# EAGLE design T1Triak+Diak (EAGLE 8.4.0)
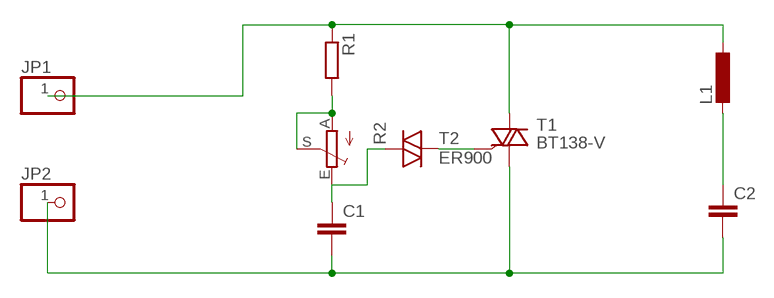
[diagram p0: schematic, sheet 1]

## Parts
C1  C-EU225-062X268  [C225-062X268]
C2  C-EU050-030X075  [C050-030X075]
JP1  PINHD-1X1  [1X01]
JP2  PINHD-1X1  [1X01]
L1  L-EU0204/5  [0204/5]
R1  R-EU_0207/10  [0207/10]
R2  TRIM_EU-B64Y  [B64Y]
T1  BT138-V  [TO220BV]
T2  ER900  [ER900]

## Nets
N$1: JP1.1 L1.1 R1.1 T1.T2(A2)
N$2: T1.G T2.2
N$3: C2.1 L1.2
N$4: C1.2 C2.2 JP2.1 T1.T1(A1)
N$5: R1.2 R2.A R2.S
N$6: C1.1 R2.E T2.1

## Library data of the parts
C1 C2 = resistor:C-EU: CAPACITOR, European symbol
JP1 JP2 = pinhead:PINHD-1X1: PIN HEADER
L1 = resistor:L-EU: INDUCTOR, European symbol
R1 = resistor:R-EU_: RESISTOR, European symbol
R2 = pot:TRIM_EU-: POTENTIOMETER
T1 = triac:BT138: TRIAC Source: http://www.semiconductors.philips.com BT138_SERIES_2.pdf
T2 = triac:ER900: TRIGGER DIODE

## Board
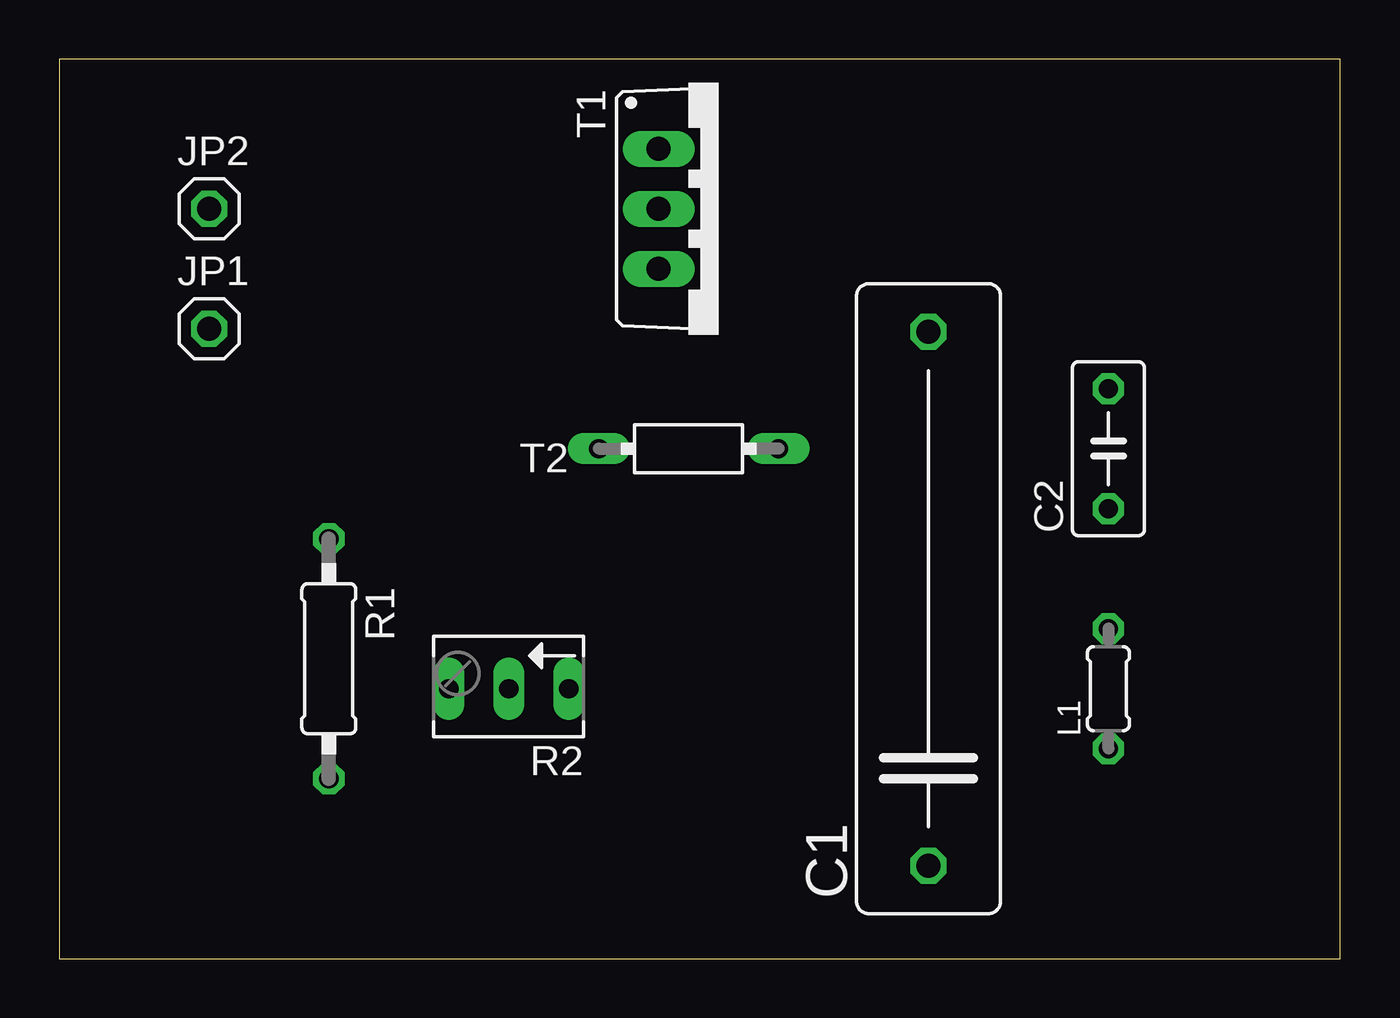
[diagram p1: board, top side]
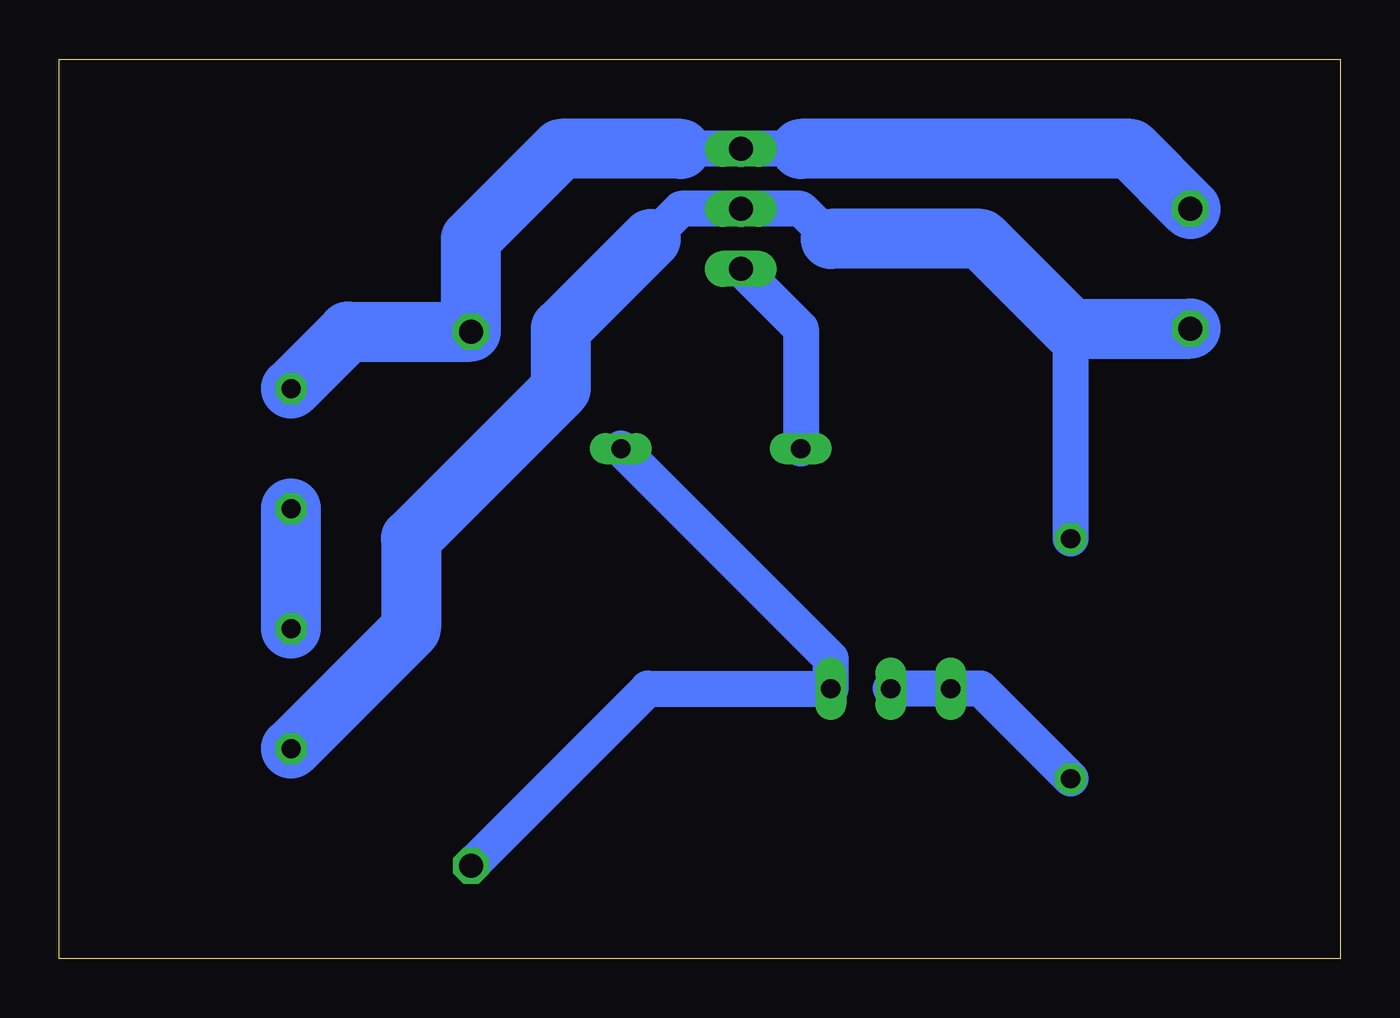
[diagram p2: board, bottom side, seen from below]

Size 54.28 x 38.09 mm. Coordinates in mm from the lower left corner, seen from the top.
Outline: 0,0 54.28,0 54.28,38.09 0,38.09 0,0
Copper layers (1*16): Top 0.035mm / dielectric 1.5mm / Bottom 0.035mm
Design rules "default": minimum track width 6mil, minimum drill 0.35mm, track to track 6mil, track to pad 6mil, pad to pad 6mil, via to via 6mil, smd to smd 6mil, copper to edge 40mil, drill to drill 6mil, minimum pad ring 10mil, minimum via ring 8mil, stop-mask expansion 4mil, vias tented up to drill 0mil, thermal gap 10mil

### Footprints (pad centres in the part's own frame; a part is rotated, then mirrored left to right if it is on the bottom)
C225-062X268 = drill 1.016 octagon: 1 -11.303,0; 2 11.303,0
C050-030X075 = drill 0.813 octagon: 1 -2.54,0; 2 2.54,0
1X01 = drill 1.016 octagon: 1 0,0
0204/5 = drill 0.813 octagon: 1 -2.54,0; 2 2.54,0
0207/10 = drill 0.813 octagon: 1 -5.08,0; 2 5.08,0
B64Y = drill 0.813 long: A 2.54,0; E -2.54,0; S 0,0
TO220BV = drill 1.016 long: G 2.54,-2.54; T1 -2.54,-2.54; T2 0,-2.54
ER900 = drill 0.813 long: 1 -3.81,0; 2 3.81,0

### Placement (x,y rotation side)
C1  36.83,15.24 90 top
C2  44.45,21.59 90 top
JP1  6.35,26.67 0 top
JP2  6.35,31.75 0 top
L1  44.45,11.43 90 top
R1  11.43,12.7 270 top
R2  19.05,11.43 180 top
T1  27.94,31.75 270 top
T2  26.67,21.59 180 top

### Tracks (layer width: path | path; a pad name or v marks a point on that pad's centre or on a via)
N$1
  Bottom 1.524: 21.59,30.48 22.86,31.75 T1.T2 27.94,31.75 29.21,30.48 | R1.1 11.43,26.67
  Bottom 2.54: JP1.1 11.43,26.67 15.24,30.48 21.59,30.48 | L1.1 39.37,13.97 39.37,17.78 33.02,24.13 33.02,26.67 29.21,30.48
N$2
  Bottom 1.524: T1.G 22.86,26.67 T2.2
N$3
  Bottom 2.54: L1.2 C2.1
N$4
  Bottom 1.524: 22.86,34.29 T1.T1 27.94,34.29
  Bottom 2.54: JP2.1 8.89,34.29 22.86,34.29 | 27.94,34.29 33.02,34.29 36.83,30.48 C1.2 42.04,26.54 C2.2
N$5
  Bottom 1.524: R1.2 15.24,11.43 R2.A R2.S
N$6
  Bottom 1.524: T2.1 21.59,12.7 R2.E 29.34,11.43 C1.1